# EAGLE schematic H-bridge (EAGLE 9.0.0)
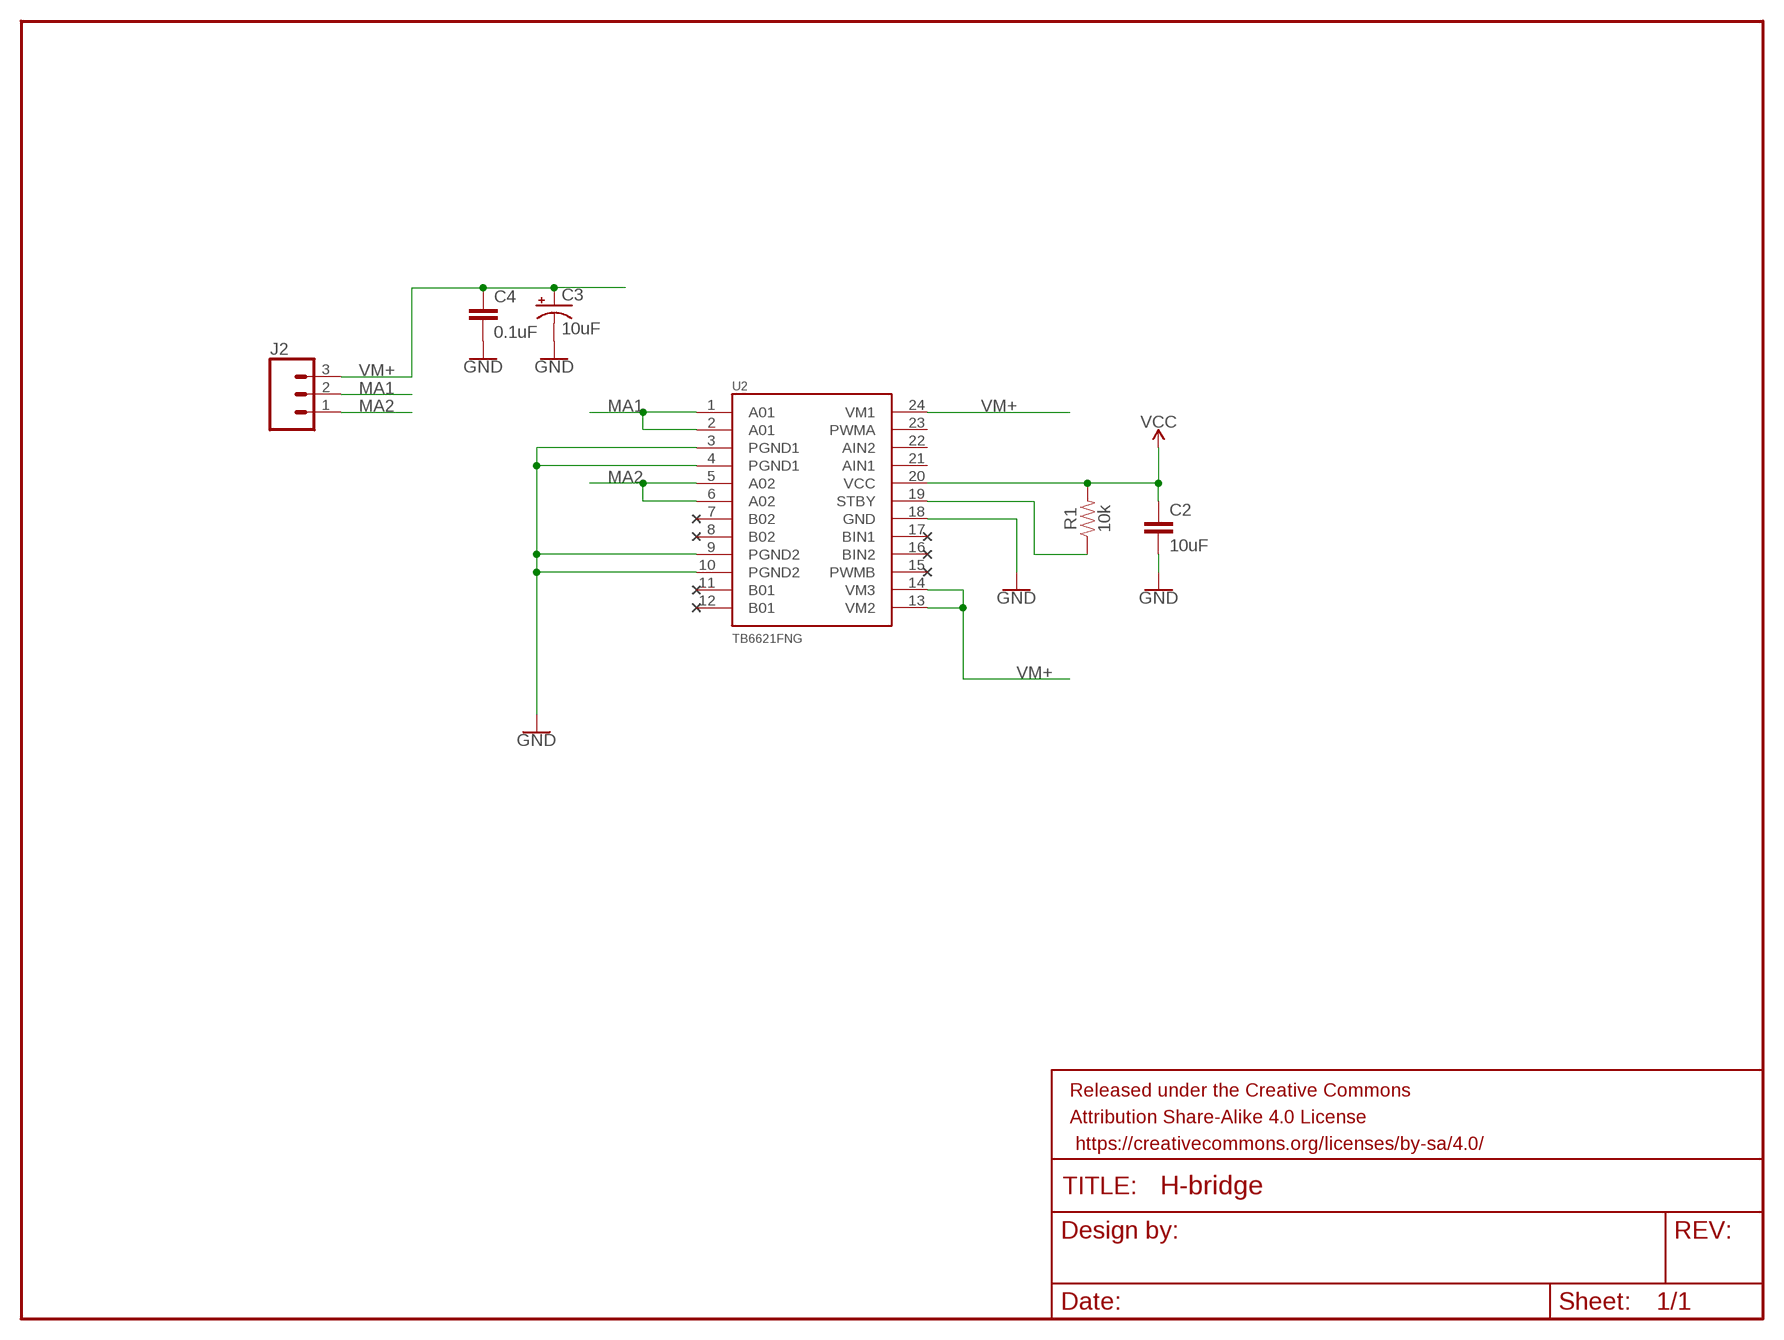
[diagram p0: schematic, sheet 1]

## Parts
C2  10uF  10UF-0805-10V-10%  [0805]
C3  10uF  10UF-POLAR-EIA3216-16V-10%(TANT)  [EIA3216]
C4  0.1uF  0.1UF-0402-16V-10%  [0402]
FRAME1  FRAME-LETTERNO_PACKAGE  [DUMMY]
J2  CONN_03POGO_PIN_HOLES_ONLY  [1X03_PP_HOLES_ONLY]
R1  10k  10KOHM-HORIZ-1/4W-5%  [AXIAL-0.3]
U2  TB6621FNG  [SSOP24]

## Nets
GND: C2.2 U2.3(PGND1) U2.4(PGND1) U2.9(PGND2) U2.10(PGND2) U2.18(GND)
MA1: J2.2
MA2: J2.1 U2.5(A02) U2.6(A02)
N$1: R1.P$1
VCC: C2.1 R1.P$2
VM+: C3.+ C4.1 J2.3 U2.13(VM2) U2.14(VM3)
Unconnected: C3.- C4.2 U2.1(A01) U2.2(A01) U2.7(B02) U2.8(B02) U2.11(B01) U2.12(B01) U2.15(PWMB) U2.16(BIN2) U2.17(BIN1) U2.19(STBY) U2.20(VCC) U2.21(AIN1) U2.22(AIN2) U2.23(PWMA) U2.24(VM1)

## Library data of the parts
C2 = SparkFun-Capacitors:10UF: 10.0µF ceramic capacitors A capacitor is a passive two-terminal electrical component used to store electrical energy temporarily in an electric field.; PROD_ID: CAP-11330
C3 = SparkFun-Capacitors:10UF-POLAR: 10.0µF polarized capacitors A capacitor is a passive two-terminal electrical component used to store electrical energy temporarily in an electric field.; PROD_ID: CAP-00811
C4 = SparkFun-Capacitors:0.1UF: 0.1µF ceramic capacitors A capacitor is a passive two-terminal electrical component used to store electrical energy temporarily in an electric field.; PROD_ID: CAP-12416
FRAME1 = SparkFun-Aesthetics:FRAME-LETTER: Schematic Frame - Letter Standard 8.5x11 US Letter frame; DESIGNER: Nobody; VERSION: v01
J2 = SparkFun-Connectors:CONN_03: Multi connection point. Often used as Generic Header-pin footprint for 0.1 inch spaced/style header connections On any of the 0.1 inch spaced packages, you can populate with these: Break Away Headers - Straight <https://www.sparkfun.com/products/116> (PRT-00116) Break Away Male Headers - Right Angle <https://www.sparkfun.com/products/553> (PRT-00553) Female Headers <https://www.sparkfun.com/products/115> (PRT-00115) Break Away Headers - Machine Pin <https://www.sparkfun.com/products/117> (PRT-00117) Break Away Female Headers - Swiss Machine Pin <https://www.sparkfun.com/products/743> (PRT-00743) Stackable Header - 3 Pin (Female, 0.1") <https://www.sparkfun.com/products/13875> (PRT-13875) For SCREWTERMINALS and SPRING TERMINALS visit here: Screw Terimnals on SparkFun.com <https://www.sparkfun.com/search/results?term=Screw+Terminals> (5mm/3.5mm/2.54mm spacing) This device is also useful as a general connection point to wire up your design to another part of your project. Our various solder wires solder well into these plated through hole pads. Hook-Up Wire - Assortment (Stranded, 22 AWG) <https://www.sparkfun.com/products/11375> (PRT-11375) Hook-Up Wire - Assortment (Solid Core, 22 AWG) <https://www.sparkfun.com/products/11367> (PRT-11367) View the entire wire category on our website here <https://www.sparkfun.com/categories/141> Special notes: Molex polarized connector foot print use with SKU : PRT-08232 with associated crimp pins and housings.
R1 = SparkFun-Resistors:10KOHM: 10kΩ resistor A resistor is a passive two-terminal electrical component that implements electrical resistance as a circuit element. Resistors act to reduce current flow, and, at the same time, act to lower voltage levels within circuits. - Wikipedia; PROD_ID: RES-09435
U2 = SparkFun:TB6621FNG: Toshiba 1A motor driver